# Altium schematic sheet LTC2320-16.SchDoc
size A3
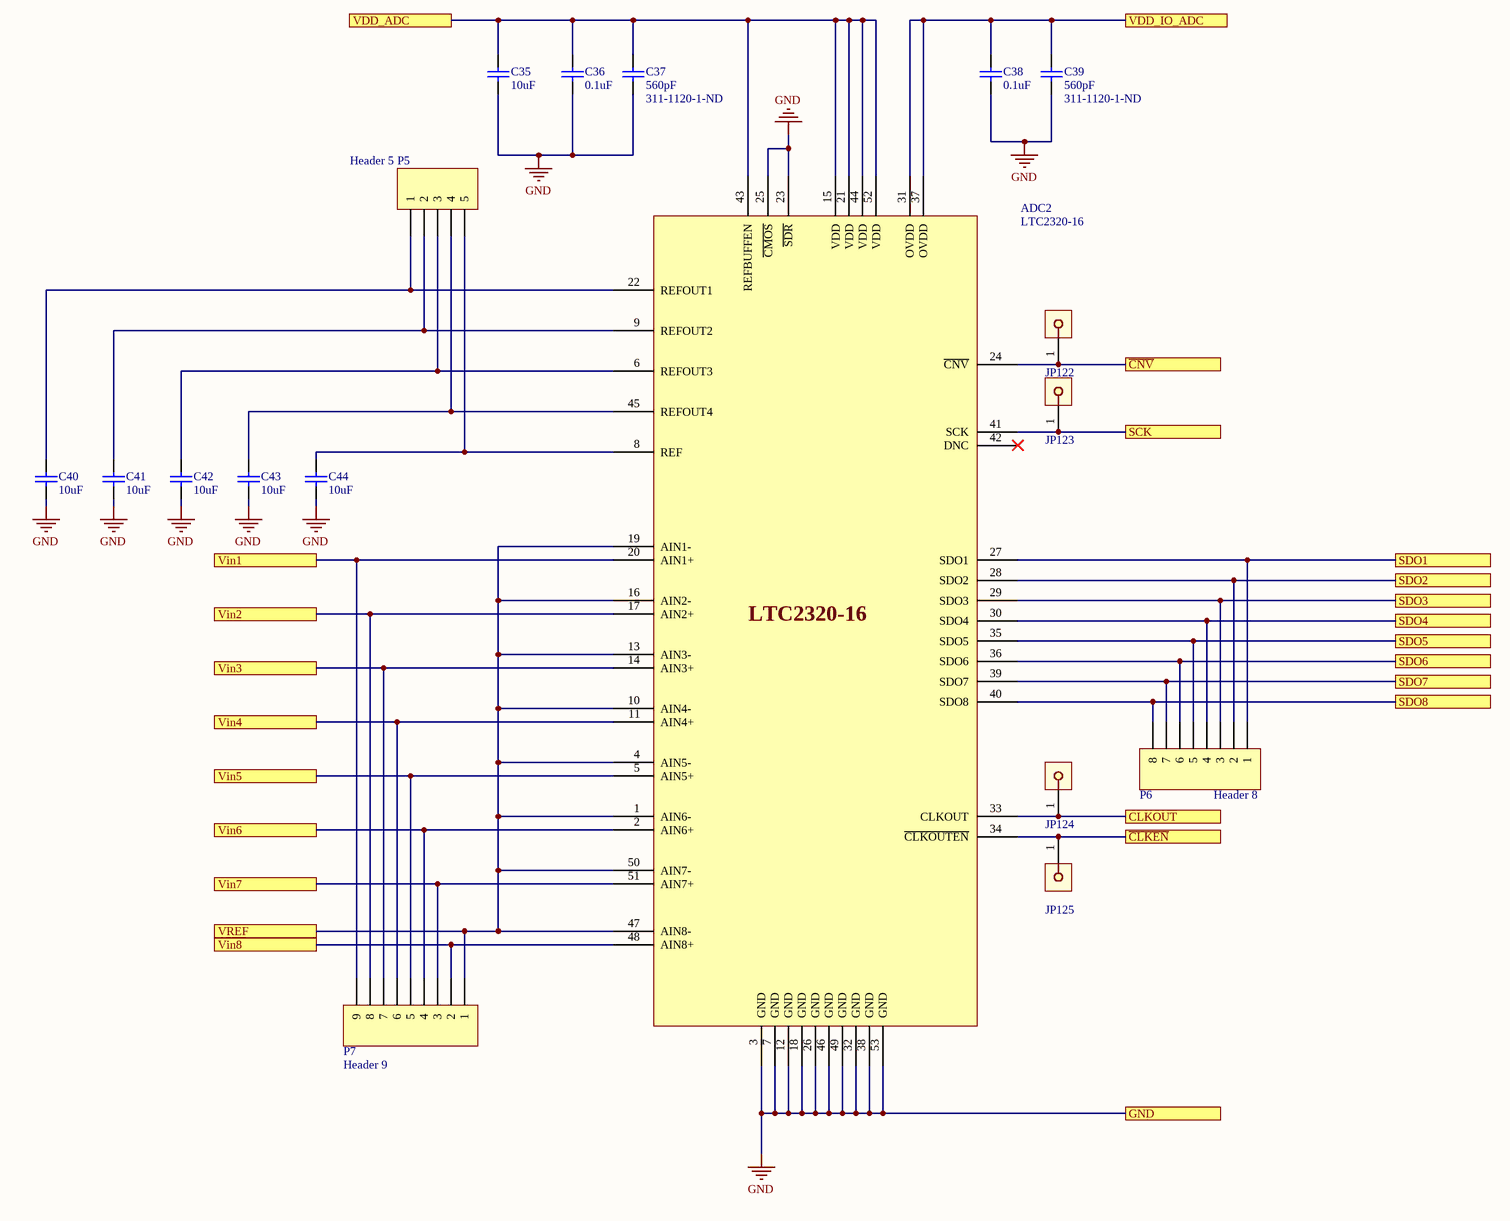
[diagram p0: LTC2320-16.SchDoc]

## Parts
ADC2  LTC2320-16  [LTC2320HUKG]
C35  10uF  [C0805]
C36  0.1uF  [C0805]
C37  560pF  Supplier Part Number 1: 311-1120-1-ND  [C0805]
C38  0.1uF  [C0805]
C39  560pF  Supplier Part Number 1: 311-1120-1-ND  [C0805]
C40  10uF  [C0805]
C41  10uF  [C0805]
C42  10uF  [C0805]
C43  10uF  [C0805]
C44  10uF  [C0805]
JP122  01x01  [01x01_0_0.1in_th_straight_b_nom]  (value not drawn)
JP123  01x01  [01x01_0_0.1in_th_straight_b_nom]  (value not drawn)
JP124  01x01  [01x01_0_0.1in_th_straight_b_nom]  (value not drawn)
JP125  01x01  [01x01_0_0.1in_th_straight_b_nom]  (value not drawn)
P5  Header 5  [HDR1X5]
P6  Header 8  [HDR1X8]
P7  Header 9  [HDR1X9]

## Ports
CLKOUT, GND, SCK, SDO1, SDO2, SDO3, SDO4, SDO5, SDO6, SDO7, SDO8, VDD_ADC, VDD_IO_ADC, Vin1, Vin2, Vin3, Vin4, Vin5, Vin6, Vin7, Vin8, VREF, ~{CLKEN}, ~{CNV}

## Nets
GND: ADC2.3(GND) ADC2.7(GND) ADC2.12(GND) ADC2.18(GND) ADC2.23(~{SDR}) ADC2.25(~{CMOS}) ADC2.26(GND) ADC2.32(GND) ADC2.38(GND) ADC2.46(GND) ADC2.49(GND) ADC2.53(GND) C35.1 C36.1 C37.1 C38.1 C39.1 C40.1 C41.1 C42.1 C43.1 C44.1 ; port GND
~{CLKEN}: ADC2.34(~{CLKOUTEN}) JP125.1 ; port ~{CLKEN}
~{CNV}: ADC2.24(~{CNV}) JP122.1 ; port ~{CNV}
CLKOUT: ADC2.33(CLKOUT) JP124.1 ; port CLKOUT
SCK: ADC2.41(SCK) JP123.1 ; port SCK
SDO1: ADC2.27(SDO1) P6.1 ; port SDO1
SDO2: ADC2.28(SDO2) P6.2 ; port SDO2
SDO3: ADC2.29(SDO3) P6.3 ; port SDO3
SDO4: ADC2.30(SDO4) P6.4 ; port SDO4
SDO5: ADC2.35(SDO5) P6.5 ; port SDO5
SDO6: ADC2.36(SDO6) P6.6 ; port SDO6
SDO7: ADC2.39(SDO7) P6.7 ; port SDO7
SDO8: ADC2.40(SDO8) P6.8 ; port SDO8
VDD_ADC: ADC2.15(VDD) ADC2.21(VDD) ADC2.43(REFBUFFEN) ADC2.44(VDD) ADC2.52(VDD) C35.2 C36.2 C37.2 ; port VDD_ADC
VDD_IO_ADC: ADC2.31(OVDD) ADC2.37(OVDD) C38.2 C39.2 ; port VDD_IO_ADC
Vin1: ADC2.20(AIN1+) P7.9 ; port Vin1
Vin2: ADC2.17(AIN2+) P7.8 ; port Vin2
Vin3: ADC2.14(AIN3+) P7.7 ; port Vin3
Vin4: ADC2.11(AIN4+) P7.6 ; port Vin4
Vin5: ADC2.5(AIN5+) P7.5 ; port Vin5
Vin6: ADC2.2(AIN6+) P7.4 ; port Vin6
Vin7: ADC2.51(AIN7+) P7.3 ; port Vin7
Vin8: ADC2.48(AIN8+) P7.2 ; port Vin8
VREF: ADC2.1(AIN6-) ADC2.4(AIN5-) ADC2.10(AIN4-) ADC2.13(AIN3-) ADC2.16(AIN2-) ADC2.19(AIN1-) ADC2.47(AIN8-) ADC2.50(AIN7-) P7.1 ; port VREF
NetADC2_6: ADC2.6(REFOUT3) C42.2 P5.3
NetADC2_8: ADC2.8(REF) C44.2 P5.5
NetADC2_9: ADC2.9(REFOUT2) C41.2 P5.2
NetADC2_22: ADC2.22(REFOUT1) C40.2 P5.1
NetADC2_45: ADC2.45(REFOUT4) C43.2 P5.4

Not connected (* = marked no-connect by the designer): ADC2 42(DNC)*

## Library data of the parts
ADC2 = LTC2320-16: Octal, 16-Bit, 1.5Msps/Ch Simultaneous Sampling ADC
C35 C40-C44 = Cap 10uF: Manufacturer: Taiyo Yuden; Manufacturer Part Number: UMK212SD103KD-T; Dielectric Material: Ceramic; Capacitance: 10nF; Tolerance: 10%; Voltage Rating: 50V; Supplier 1: Digi-Key; Stock 1: 14125; Pricing 1: 1=0.47, 10=0.323, 100=0.1941, 500=0.1455, 1000=0.1229 (USD); Mount: Surface Mount; Case/Package: 0805; Number of Pins: 2; Case Code (Metric): 2012; Case Code (Imperial): 0805; Min Operating Temperature: -55°C; Max Operating Temperature: 125°C; Packaging: Tape and Reel; Package Quantity: 1; Voltage Rating (DC): 50V; Termination: SMD/SMT; Length: 2mm; Height: 0.85mm; Width: 0.049inch; Thickness: 0.037inch; Depth: 1.25mm; Radiation Hardening: No; Lead Free: Lead Free; Halogen Free: Halogen Free; ComponentLink1URL: https://datasheet.ciiva.com/138/umk212sd103kd-t-ss-138661.pdf; ComponentLink1Description: https://datasheet.ciiva.com/138/umk212sd103kd-t-ss-138661.pdf; ComponentLink2URL: https://datasheet.ciiva.com/138/mlcc07-e-138662.pdf; ComponentLink2Description: https://datasheet.ciiva.com/138/mlcc07-e-138662.pdf; ComponentLink3URL: https://datasheet.ciiva.com/138/mlcc07-e-138663.pdf; ComponentLink3Description: https://datasheet.ciiva.com/138/mlcc07-e-138663.pdf; ComponentLink4URL: https://datasheet.ciiva.com/30140/303umk212sd103kd-t-30140925.pdf; ComponentLink4Description: https://datasheet.ciiva.com/30140/303umk212sd103kd-t-30140925.pdf; Supplier Part Number 1: 587-1114-1-ND
C36 C38 = Cap 0.1uF: Manufacturer: Taiyo Yuden; Manufacturer Part Number: UMK212SD103KD-T; Dielectric Material: Ceramic; Capacitance: 10nF; Tolerance: 10%; Voltage Rating: 50V; Supplier 1: Digi-Key; Stock 1: 14125; Pricing 1: 1=0.47, 10=0.323, 100=0.1941, 500=0.1455, 1000=0.1229 (USD); Mount: Surface Mount; Case/Package: 0805; Number of Pins: 2; Case Code (Metric): 2012; Case Code (Imperial): 0805; Min Operating Temperature: -55°C; Max Operating Temperature: 125°C; Packaging: Tape and Reel; Package Quantity: 1; Voltage Rating (DC): 50V; Termination: SMD/SMT; Length: 2mm; Height: 0.85mm; Width: 0.049inch; Thickness: 0.037inch; Depth: 1.25mm; Radiation Hardening: No; Lead Free: Lead Free; Halogen Free: Halogen Free; ComponentLink1URL: https://datasheet.ciiva.com/138/umk212sd103kd-t-ss-138661.pdf; ComponentLink1Description: https://datasheet.ciiva.com/138/umk212sd103kd-t-ss-138661.pdf; ComponentLink2URL: https://datasheet.ciiva.com/138/mlcc07-e-138662.pdf; ComponentLink2Description: https://datasheet.ciiva.com/138/mlcc07-e-138662.pdf; ComponentLink3URL: https://datasheet.ciiva.com/138/mlcc07-e-138663.pdf; ComponentLink3Description: https://datasheet.ciiva.com/138/mlcc07-e-138663.pdf; ComponentLink4URL: https://datasheet.ciiva.com/30140/303umk212sd103kd-t-30140925.pdf; ComponentLink4Description: https://datasheet.ciiva.com/30140/303umk212sd103kd-t-30140925.pdf; Supplier Part Number 1: 587-1114-1-ND
C37 C39 = Cap 560pF: Manufacturer: Taiyo Yuden; Manufacturer Part Number: UMK212SD103KD-T; Dielectric Material: Ceramic; Capacitance: 10nF; Tolerance: 10%; Voltage Rating: 50V; Stock 1: 14125; Pricing 1: 1=0.47, 10=0.323, 100=0.1941, 500=0.1455, 1000=0.1229 (USD); Mount: Surface Mount; Case/Package: 0805; Number of Pins: 2; Case Code (Metric): 2012; Case Code (Imperial): 0805; Min Operating Temperature: -55°C; Max Operating Temperature: 125°C; Packaging: Tape and Reel; Package Quantity: 1; Voltage Rating (DC): 50V; Termination: SMD/SMT; Length: 2mm; Height: 0.85mm; Width: 0.049inch; Thickness: 0.037inch; Depth: 1.25mm; Radiation Hardening: No; Lead Free: Lead Free; Halogen Free: Halogen Free; ComponentLink1URL: https://datasheet.ciiva.com/138/umk212sd103kd-t-ss-138661.pdf; ComponentLink1Description: https://datasheet.ciiva.com/138/umk212sd103kd-t-ss-138661.pdf; ComponentLink2URL: https://datasheet.ciiva.com/138/mlcc07-e-138662.pdf; ComponentLink2Description: https://datasheet.ciiva.com/138/mlcc07-e-138662.pdf; ComponentLink3URL: https://datasheet.ciiva.com/138/mlcc07-e-138663.pdf; ComponentLink3Description: https://datasheet.ciiva.com/138/mlcc07-e-138663.pdf; ComponentLink4URL: https://datasheet.ciiva.com/30140/303umk212sd103kd-t-30140925.pdf; ComponentLink4Description: https://datasheet.ciiva.com/30140/303umk212sd103kd-t-30140925.pdf; Supplier 1: Digi-Key
JP122-JP125 = 01x01: 01X01 generic terminal connector
P5 = Header 5: Header, 5-Pin; LatestRevisionDate: 17-Jul-2002; LatestRevisionNote: Re-released for DXP Platform.; Publisher: Altium Limited
P6 = Header 8: Header, 8-Pin; LatestRevisionDate: 17-Jul-2002; LatestRevisionNote: Re-released for DXP Platform.; Publisher: Altium Limited
P7 = Header 9: Header, 9-Pin; LatestRevisionDate: 17-Jul-2002; LatestRevisionNote: Re-released for DXP Platform.; Publisher: Altium Limited